# Altium project regulated_power_supply_board.PrjPcb
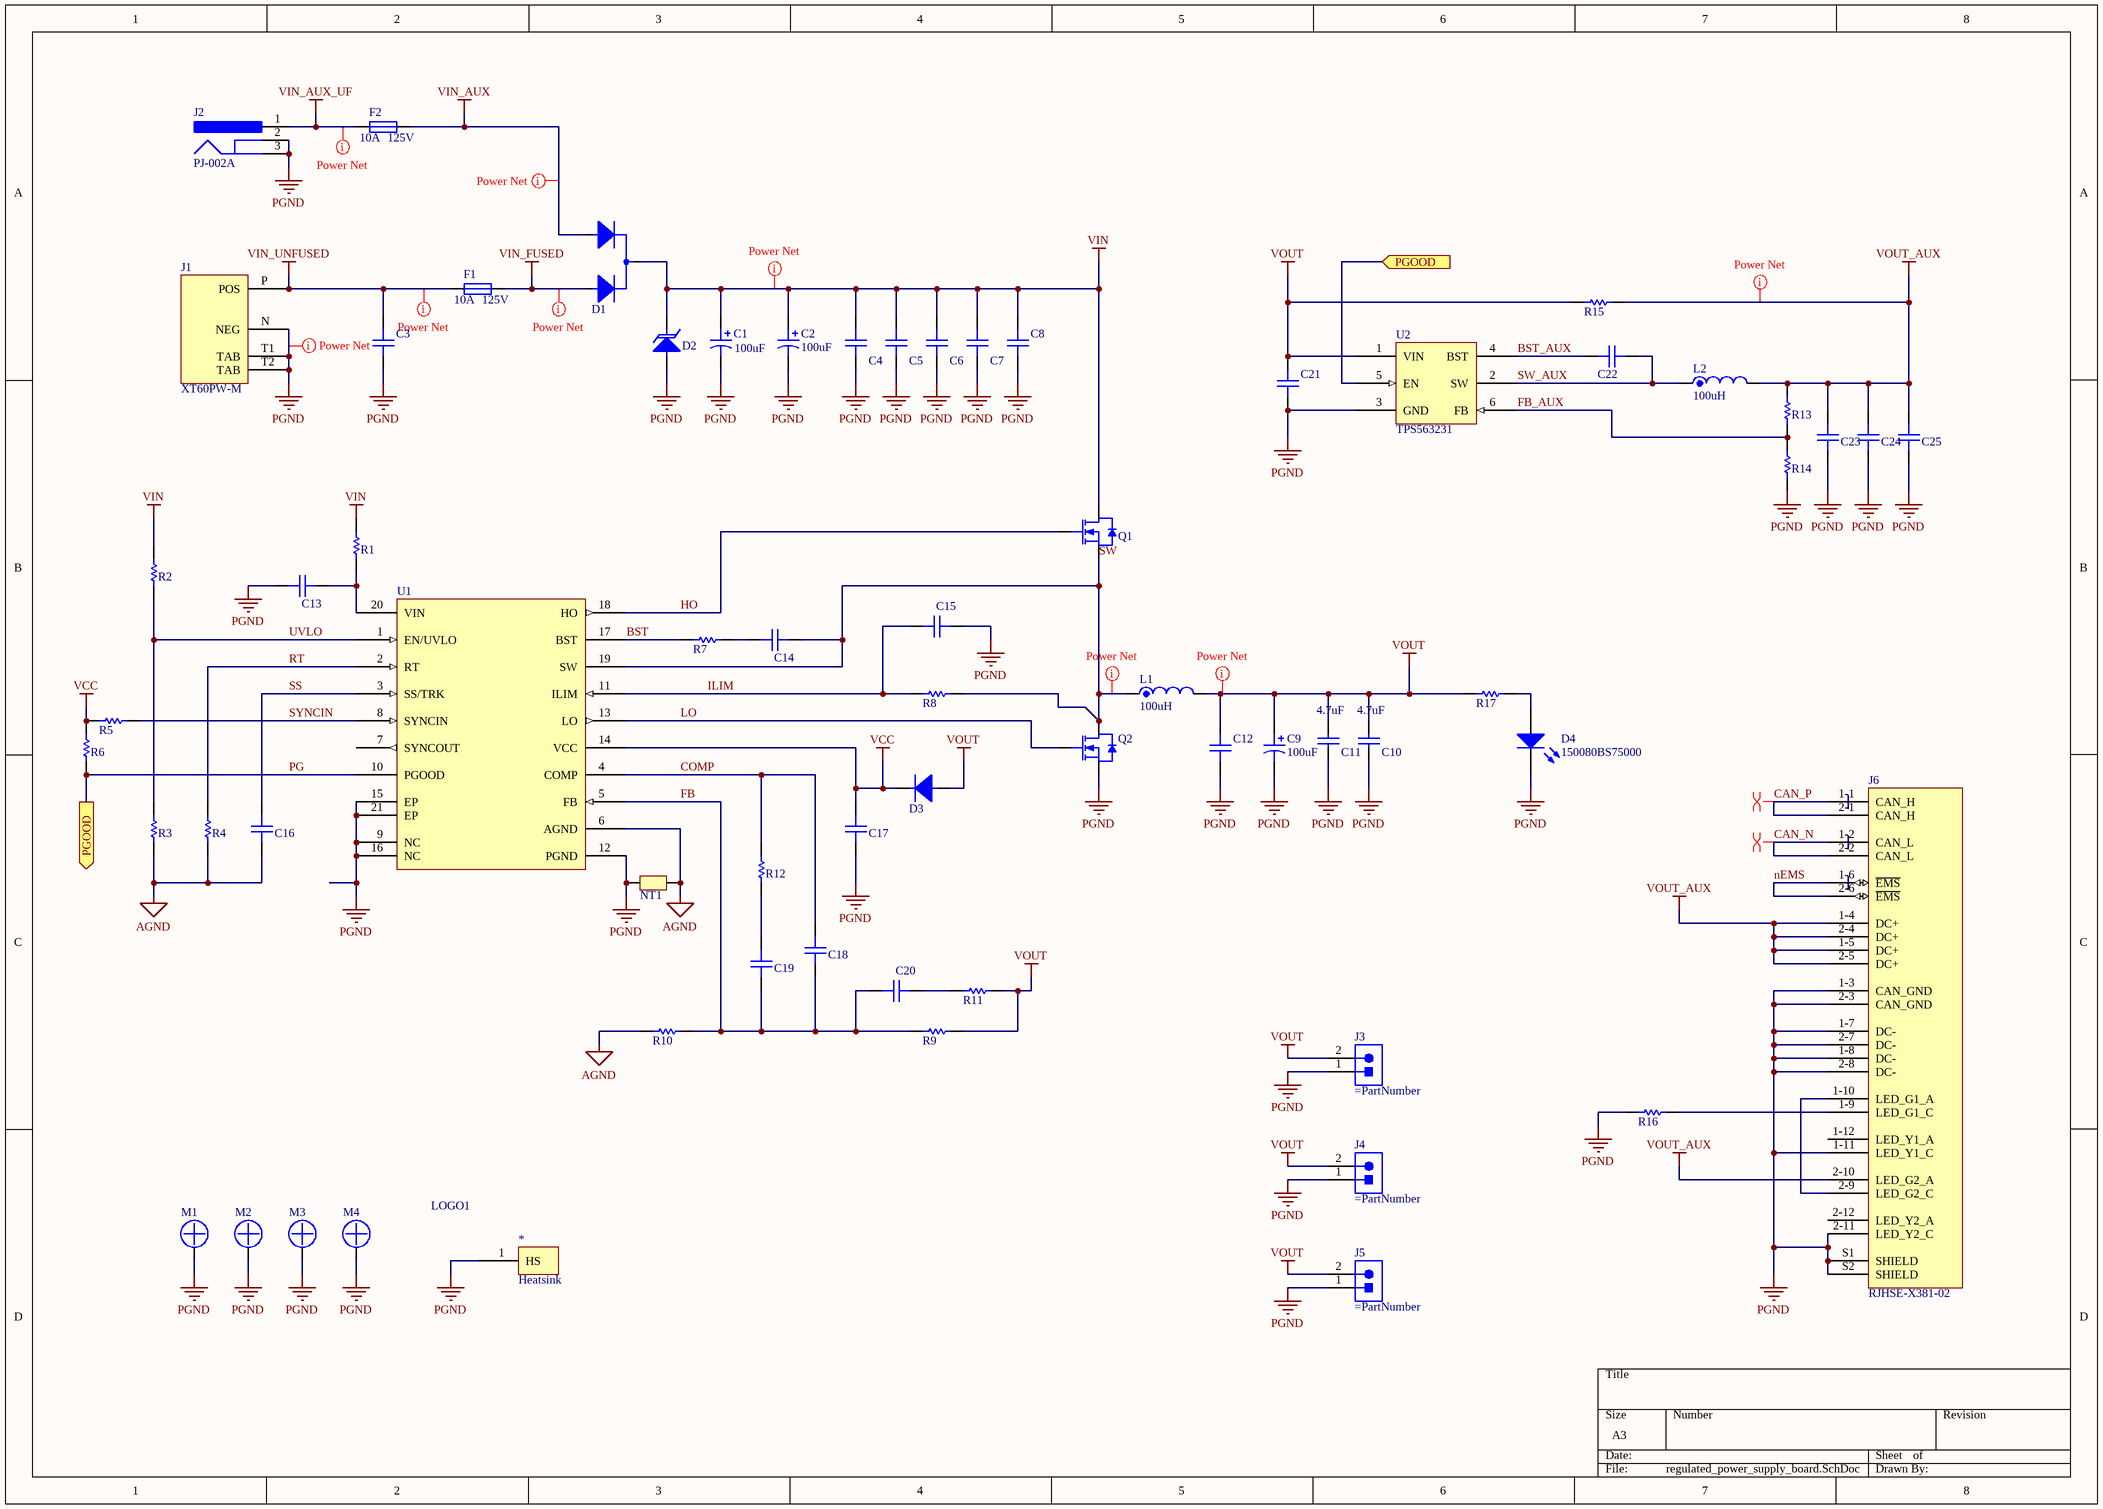
[diagram p0: regulated_power_supply_board.SchDoc]
1 sheet, 67 parts. Net scope: flat (ports and power ports of the same name join across sheets).
Board file: regulated_power_supply_board.PcbDoc

## Sheet regulated_power_supply_board.SchDoc
size A3

### Parts
*  Heatsink  [HS_2510]
C1  100uF  [CPOL_8x11_5_THRU]
C2  100uF  [CPOL_8x11_5_THRU]
C3  (no value)  [C0603N]
C4  (no value)  [C1210N]
C5  (no value)  [C1210N]
C6  (no value)  [C1210N]
C7  (no value)  [C1210N]
C8  (no value)  [C0603N]
C9  100uF  [CPOL_8x11_5_THRU]
C10  Capacitance: 4.7uF  [C1210N]
C11  Capacitance: 4.7uF  [C1210N]
C12  (no value)  [C0603N]
C13  (no value)  [C0603N]
C14  (no value)  [C0603N]
C15  (no value)  [C0603N]
C16  (no value)  [C0603N]
C17  (no value)  [C0603N]
C18  (no value)  [C0603N]
C19  (no value)  [C0603N]
C20  (no value)  [C0603N]
C21  (no value)  [C0603N]
C22  (no value)  [C0603N]
C23  (no value)  [C0603N]
C24  (no value)  [C0805N]
C25  (no value)  [C0805N]
D1  (no value)  [DPAK_JEDEC_N]
D2  (no value)  [SMB]
D3  (no value)  [SOD323FLN]
D4  150080BS75000  [0805_A]
F1  Fuse Current: 10A  Voltage Rating (AC): 125V  [Littelfuse_157]
F2  Fuse Current: 10A  Voltage Rating (AC): 125V  [Littelfuse_157]
J1  XT60PW-M  [XT60PW-M]
J2  PJ-002A  [CUI-PJ-002A_V]
J3  (no value)  [43045-020X]
J4  (no value)  [43045-020X]
J5  (no value)  [43045-020X]
J6  RJHSE-X381-02  [RJHSE-X38X-02]
L1  100uH  [SRP1265A]
L2  100uH  [VLS5045EX_TDK]
LOGO1  LOGO  [LOGO_designed_by_ysk]  (value not drawn)  (graphical)
M1  Mounting_Screw  [MOUNT_HOLE_3.2]  (value not drawn)
M2  Mounting_Screw  [MOUNT_HOLE_3.2]  (value not drawn)
M3  Mounting_Screw  [MOUNT_HOLE_3.2]  (value not drawn)
M4  Mounting_Screw  [MOUNT_HOLE_3.2]  (value not drawn)
NT1  Net tie  [NET_TIE_0_2]  (value not drawn)  (net tie, no BOM)
Q1  MOSFET-N  [DFN-5 (SO-8FL)]  (value not drawn)
Q2  MOSFET-N  [DFN-5 (SO-8FL)]  (value not drawn)
R1  (no value)  [R0603N]
R2  (no value)  [R0603N]
R3  (no value)  [R0603N]
R4  (no value)  [R0603N]
R5  (no value)  [R0603N]
R6  (no value)  [R0603N]
R7  (no value)  [R0603N]
R8  (no value)  [R0603N]
R9  (no value)  [R0603N]
R10  (no value)  [R0603N]
R11  (no value)  [R0603N]
R12  (no value)  [R0603N]
R13  (no value)  [R0603N]
R14  (no value)  [R0603N]
R15  (no value)  [R1206N]
R16  (no value)  [R0603N]
R17  (no value)  [R0603N]
U1  (no value)  [RGY0020B_TI_N]
U2  TPS563231  [DRL0006A_TI_N]

### Ports
PGOOD (in), PGOOD (out)

### Nets
AGND: C16.1 NT1.2 R3.1 R4.1 R10.1 U1.6(AGND)
PGND: *.1(HS) C1.2 C2.2 C3.2 C4.1 C5.1 C6.1 C7.1 C8.2 C9.2 C10.1 C11.1 C12.2 C13.2 C15.1 C17.1 C21.2 C23.2 C24.1 C25.1 D2.2(A) D4.1(K) J1.N(NEG) J1.T1(TAB) J1.T2(TAB) J2.2 J2.3 J3.1 J4.1 J5.1 J6.1-3(CAN_GND) J6.1-7(DC-) J6.1-8(DC-) J6.1-11(LED_Y1_C) J6.2-3(CAN_GND) J6.2-7(DC-) J6.2-8(DC-) J6.2-11(LED_Y2_C) J6.S1(SHIELD) J6.S2(SHIELD) M1.1 M2.1 M3.1 M4.1 NT1.1 Q2.S R14.1 R16.2 U1.9(NC) U1.12(PGND) U1.15(EP) U1.16(NC) U1.21(EP) U2.3(GND)
VCC: C17.2 D3.1(C) R5.2 R6.2 U1.14(VCC)
VIN: C1.1 C2.1 C4.2 C5.2 C6.2 C7.2 C8.1 D1.2(C) D2.1(C) Q1.D R1.1 R2.2
VIN_AUX: D1.3(A2) F2.2
VIN_AUX_UF: F2.1 J2.1
VIN_FUSED: D1.1(A1) F1.2
VIN_UNFUSED: C3.1 F1.1 J1.P(POS)
VOUT: C9.1 C10.2 C11.2 C12.1 C21.1 D3.2(A) J3.2 J4.2 J5.2 L1.2 R9.2 R11.2 R15.1 R17.2 U2.1(VIN)
VOUT_AUX: C23.1 C24.2 C25.2 J6.1-4(DC+) J6.1-5(DC+) J6.2-4(DC+) J6.2-5(DC+) J6.2-10(LED_G2_A) L2.2 R13.2 R15.2
BST: R7.1 U1.17(BST)
BST_AUX: C22.1 U2.4(BST)
CAN_N: J6.1-2(CAN_L) J6.2-2(CAN_L)
CAN_P: J6.1-1(CAN_H) J6.2-1(CAN_H)
COMP: C18.1 R12.2 U1.4(COMP)
FB: C18.2 C19.2 C20.2 R9.1 R10.2 U1.5(FB)
FB_AUX: R13.1 R14.2 U2.6(FB)
HO: Q1.G U1.18(HO)
ILIM: C15.2 R8.1 U1.11(ILIM)
LO: Q2.G U1.13(LO)
nEMS: J6.1-6(~{EMS}) J6.2-6(~{EMS})
PG: R6.1 U1.10(PGOOD) U2.5(EN) ; port PGOOD
RT: R4.2 U1.2(RT)
SS: C16.2 U1.3(SS/TRK)
SW: C14.1 L1.1 Q1.S Q2.D R8.2 U1.19(SW)
SW_AUX: C22.2 L2.1 U2.2(SW)
SYNCIN: R5.1 U1.8(SYNCIN)
UVLO: R2.1 R3.2 U1.1(EN/UVLO)
NetC13_1: C13.1 R1.2 U1.20(VIN)
NetC14_2: C14.2 R7.2
NetC19_1: C19.1 R12.1
NetC20_1: C20.1 R11.1
NetD4_2: D4.2(A) R17.1
NetJ6_1-9: J6.1-9(LED_G1_C) R16.1
NetJ6_1-10: J6.1-10(LED_G1_A) J6.2-9(LED_G2_C)

Not connected (* = marked no-connect by the designer): J6 1-12(LED_Y1_A) 2-12(LED_Y2_A); U1 7(SYNCOUT)

### Layout directives
net class Power: PGND, SW, VIN, VIN_AUX, VIN_AUX_UF, VIN_FUSED, VIN_UNFUSED, VOUT, VOUT_AUX
differential pair: CAN_N, CAN_P

### Library data of the parts
C1 C2 C9 = CPOL
C3-C8 C12-C25 = C
  C13-C20: ClassName: Controller
C10 C11 = C: Ceramic capacitor 1210 X7R 50V 4.7uF; Manufacturer: Taiyo Yuden; Manufacturer Part Number: UMK325B7475MM-T; Tolerance: 20%; Supplier 1: Avnet; Supplier Part Number 1: UMK325B7475MM-T; RoHS: Yes; Category: Ceramic Capacitors; Pricing 1: 500=0.11860, 1000=0.10876, 2000=0.10029, 3000=0.09316, 5000=0.08688 (USD); Mount: Surface Mount; Case/Package: 1210; Case Code (Metric): 3225; Case Code (Imperial): 1210; Min Operating Temperature: -55°C; Max Operating Temperature: 125°C; Voltage Rating: 50V; Packaging: Tape and Reel; Dielectric: X7R; Voltage Rating (DC): 50V; Termination: SMD/SMT; Package Quantity: 500; Voltage: 50V; Length: 3.2mm; Height: 2.5mm; Width: 0.098inch; Thickness: 0.106inch; Depth: 2.5mm; Radiation Hardening: No; Halogen Free: Halogen Free; Lead Free: Lead Free; REACH SVHC: Unknown; ComponentLink1URL: https://datasheet.ciiva.com/2990/umk325b7475mm-t-ss-2990073.pdf?src-supplier=Avnet; ComponentLink1Description: https://datasheet.ciiva.com/2990/umk325b7475mm-t-ss-2990073.pdf?src-supplier=Avnet; ComponentLink2URL: https://datasheet.ciiva.com/141/umk325b7475mm-t-ss-141867.pdf?src-supplier=Digi-Key; ComponentLink2Description: https://datasheet.ciiva.com/141/umk325b7475mm-t-ss-141867.pdf?src-supplier=Digi-Key; ComponentLink3URL: https://datasheet.ciiva.com/5441/mlcc-all-e-541559-5441759.pdf?src-supplier=Mouser; ComponentLink3Description: https://datasheet.ciiva.com/5441/mlcc-all-e-541559-5441759.pdf?src-supplier=Mouser
D1 = D_CC: Diode, Common Cathode; pin to pad: 2>4
D2 = TVS
D3 = D
D4 = CMP-1426-00008-1: SMD mono-color Chip LED, WL-SMCW, Blue; Manufacturer: Wuerth Elektronik; Color: Blue; ComponentLink2URL: http://katalog.we-online.com/led/datasheet/150080BS75000.pdf; ComponentLink1URL: http://www.we-online.com; ComponentLink2Description: Datasheet; PackageReference: 0805_A; ComponentLink1Description: Manufacturer URL; PartNumber: 150080BS75000
F1 F2 = Littelfuse_157: FUSE CLIP W/ 10A FUSE, FAST ACTING - More Details; Manufacturer Part Number: 0157010.DR; DC Cold Resistance: 5.8mR; Fuse Type: Board Mount (Cartridge Style Excluded); Approvals: cULus,PSE; Supplier 1: Digi-Key; Supplier Part Number 1: F2973CT-ND; Manufacturer: Littelfuse; RoHS: Yes; Category: Fuses; Stock 1: 8274; Pricing 1: 1=2.73000, 5=2.60000, 10=2.47000, 50=1.99360, 100=1.69030, 250=1.64692, 500=1.38688 (USD); Mount: Surface Mount,Holder; Case/Package: SMD/SMT; Number of Pins: 2; Housing Material: Ceramic; Min Operating Temperature: -55°C; Max Operating Temperature: 125°C; Voltage Rating (DC): 125V; Current Rating: 10A; Packaging: Tape and Reel; Package Quantity: 1500; Resistance: 5.8mR; Length: 6.5mm; Height: 0.154inch; Depth: 3.7mm; Width: 0.146inch; Radiation Hardening: No; REACH SVHC: No SVHC; Lead Free: Lead Free; ComponentLink1URL: https://datasheet.ciiva.com/1221/682285-1221410.pdf?src-supplier=Newark; ComponentLink1Description: https://datasheet.ciiva.com/1221/682285-1221410.pdf?src-supplier=Newark; ComponentLink2URL: https://datasheet.ciiva.com/300/littelfuse-fuse-157-300246.pdf?src-supplier=Digi-Key; ComponentLink2Description: https://datasheet.ciiva.com/300/littelfuse-fuse-157-300246.pdf?src-supplier=Digi-Key; ComponentLink3URL: https://datasheet.ciiva.com/300/littelfuse-fuse-157-300247.pdf?src-supplier=Digi-Key; ComponentLink3Description: https://datasheet.ciiva.com/300/littelfuse-fuse-157-300247.pdf?src-supplier=Digi-Key; ComponentLink4URL: https://datasheet.ciiva.com/1268/479491-1268801.pdf?src-supplier=Element14; ComponentLink4Description: https://datasheet.ciiva.com/1268/479491-1268801.pdf?src-supplier=Element14; ComponentLink5URL: https://datasheet.ciiva.com/1268/littelfuse-fuse-157-1268995.pdf?src-supplier=Element14; ComponentLink5Description: https://datasheet.ciiva.com/1268/littelfuse-fuse-157-1268995.pdf?src-supplier=Element14; ComponentLink6URL: https://datasheet.ciiva.com/1272/479491-1272582.pdf?src-supplier=Farnell; ComponentLink6Description: https://datasheet.ciiva.com/1272/479491-1272582.pdf?src-supplier=Farnell; ComponentLink7URL: https://datasheet.ciiva.com/300/littelfuse-fuse-157-300248.pdf?src-supplier=Digi-Key; ComponentLink7Description: https://datasheet.ciiva.com/300/littelfuse-fuse-157-300248.pdf?src-supplier=Digi-Key; ComponentLink8URL: https://datasheet.ciiva.com/26845/getdatasheetpartid-343817-26845370.pdf?src-supplier=Verical; ComponentLink8Description: https://datasheet.ciiva.com/26845/getdatasheetpartid-343817-26845370.pdf?src-supplier=Verical; ComponentLink9URL: https://datasheet.ciiva.com/1272/littelfuse-fuse-157-1272878.pdf?src-supplier=Farnell; ComponentLink9Description: https://datasheet.ciiva.com/1272/littelfuse-fuse-157-1272878.pdf?src-supplier=Farnell
J1 = XT60PW-M: XT60, Male, THT, R/A
J2 = CMP-2000-06895-1: Through Hole Right Angle DC Power Jack, 2.5 A, 2 mm Center Pin, 3 Position, -25 to 85 degC, RoHS, Bulk; Manufacturer: CUIInc.; Manufacturer Part Number: PJ-002B; Current Rating: 2.5A; Inside Contact Diameter: 2mm; Insulation Resistance: 50MOhms; Outside Contact Diameter: 6.5mm; Voltage Rating: 24V; Brand: CUI; Gender: Male; Shielding: Unshielded; Number of Conductors: 2; Operating Temperature Range: -25Cto+85C; Mounting Technology: ThroughHole; Connector Type: DCPowerJack; Contact Material: Copper; Datasheet URL: http://www.cui.com/product/resource/pj-002a.pdf; Contact Gender: Male; Housing Material: PolybutyleneTerephthalate(PBT); Manufacturer URL: http://www.cui.com/; Package Reference: PJ-002A; Mounting Style: ThroughHole; Mounting Angle: Right; Product Category: DCPowerConnectors; Product: Jacks; Flammability Rating: UL94V-0; Contact Plating: Nickel; RoHS: True; Datasheet Version: Rev. 1.03, 04/2016; Package Description: 3-Pin Through Hole Device, Body 14.4 x 9 mm, Height 11 mm; Factory Pack Quantity: 500; Termination Style: ThroughHole; Supplier 1: Digi-Key; Supplier Part Number 1: CP-002B-ND; Category: Connectors; Stock 1: 14399; Pricing 1: 1=0.60000, 10=0.55800, 25=0.50240, 50=0.44640, 100=0.42780, 250=0.39060, 500=0.37200, 1000=0.30690, 2500=0.27900 (USD); Mount: Through Hole; Color: Black; Housing Color: Black; Min Operating Temperature: -25°C; Max Operating Temperature: 85°C; Termination: Through Hole; Package Quantity: 500; Orientation: Horizontal; Packaging: Bulk; Diameter: 2.5mm; Lead Free: Lead Free; ComponentLink1URL: http://www.mouser.com/ds/2/670/pj-002b-515833.pdf?src-supplier=Mouser; ComponentLink1Description: http://www.mouser.com/ds/2/670/pj-002b-515833.pdf?src-supplier=Mouser; ComponentLink2URL: http://www.cui.com/Product/Resource/FuturePDF/PJ-002B.pdf?src-supplier=Future+Electronics; ComponentLink2Description: http://www.cui.com/Product/Resource/FuturePDF/PJ-002B.pdf?src-supplier=Future+Electronics; ComponentLink3URL: https://www.cui.com/product/resource/digikeypdf/pj-002b.pdf?src-supplier=Digi-Key; ComponentLink3Description: https://www.cui.com/product/resource/digikeypdf/pj-002b.pdf?src-supplier=Digi-Key
J3-J5 = 43045-020X: Molex Micro-Fit 3.0, 2POS, R/A w/Pegs, Dual row
L1 L2 = L
R1-R17 = R
  R1-R5 R7-R12: ClassName: Controller
U1 = LM25145: ClassName: Controller